# Altium schematic sheet MainSchematic.SchDoc
size A3
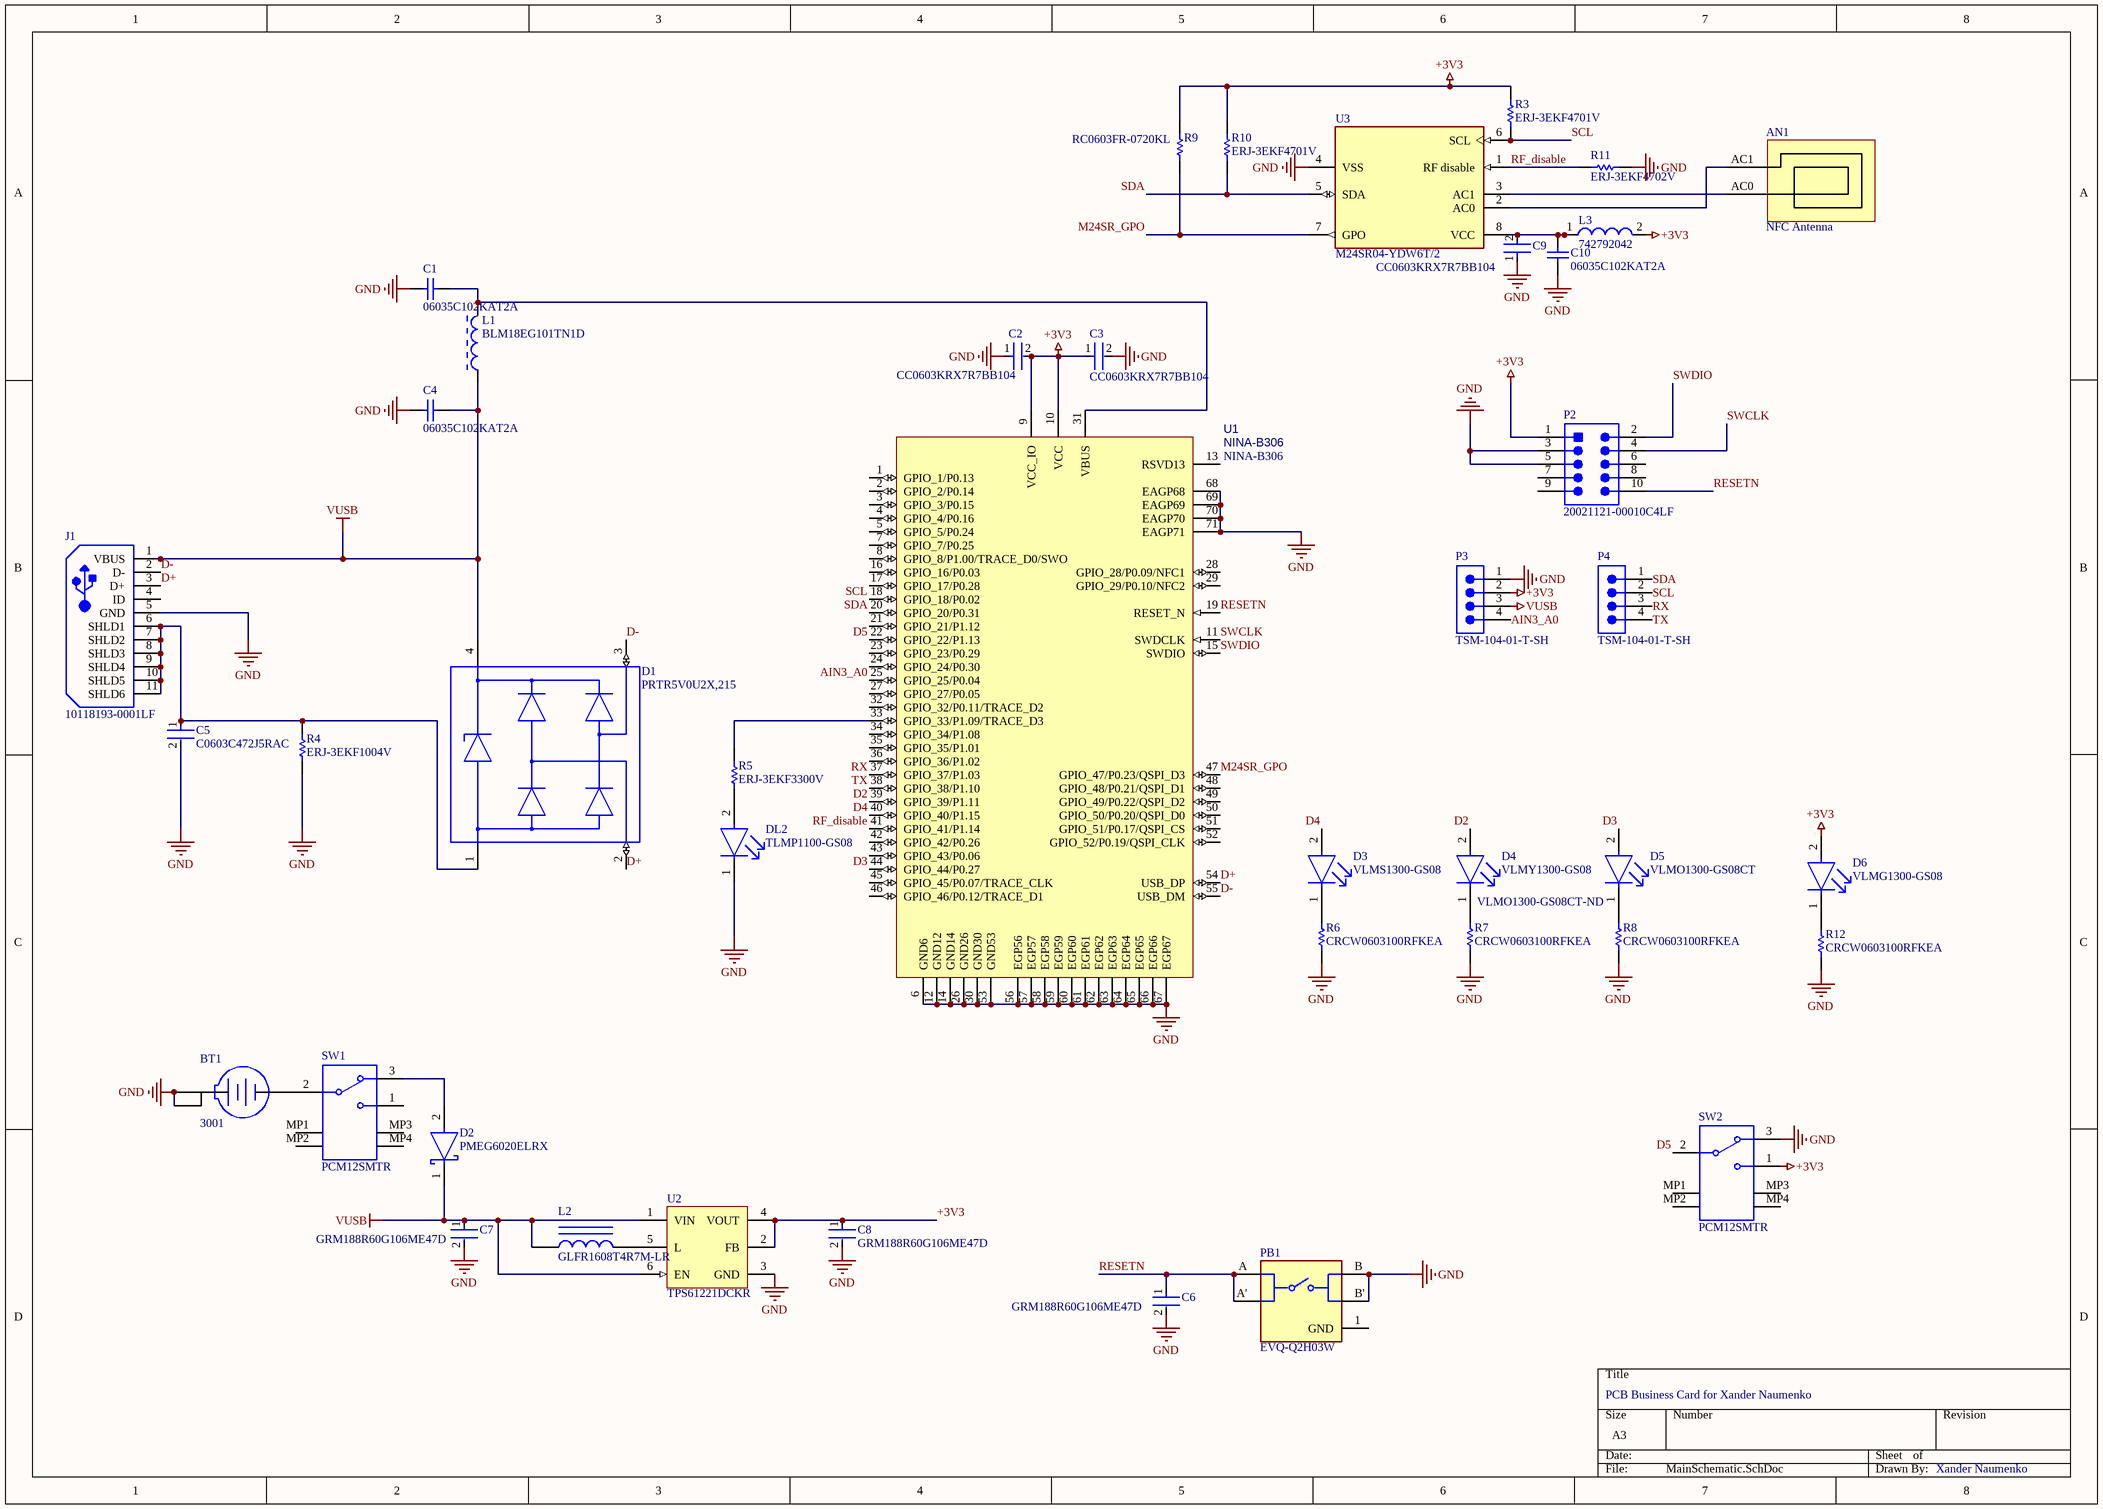
[diagram p0: MainSchematic.SchDoc]

## Parts
AN1  NFC Antenna  [NFC_Antenna]
BT1  3001  [KSTN-3001_V]
C1  06035C102KAT2A  [CAPC1608X90X35LL15T15]
C2  CC0603KRX7R7BB104  [FP-CC0603-DA-MFG]
C3  CC0603KRX7R7BB104  [FP-CC0603-DA-MFG]
C4  06035C102KAT2A  [CAPC1608X90X35LL15T15]
C5  C0603C472J5RAC  [FP-C0603C-CF-MFG]
C6  GRM188R60G106ME47D  [FP-GRM188-0_1-e0_2_0_55-IPC_B]
C7  GRM188R60G106ME47D  [FP-GRM188-0_1-e0_2_0_55-IPC_B]
C8  GRM188R60G106ME47D  [FP-GRM188-0_1-e0_2_0_55-IPC_B]
C9  CC0603KRX7R7BB104  [FP-CC0603-DA-MFG]
C10  06035C102KAT2A  [CAPC1608X90X35LL15T15]
D1  PRTR5V0U2X,215  [FP-SOT143B-MFG]
D2  PMEG6020ELRX  [FP-SOD123W-MFG]
D3  VLMS1300-GS08  [FP-6_541-5092_01-4-MFG]
D4  VLMY1300-GS08  Supplier Part Number 1: VLMO1300-GS08CT-ND  [FP-6_541-5092_01-4-MFG]
D5  VLMO1300-GS08CT  [FP-6_541-5092_01-4-MFG]
D6  VLMG1300-GS08  [FP-6_541-5092_01-4-MFG]
DL2  TLMP1100-GS08  [FP-6_541-5056_01-4-MFG]
J1  10118193-0001LF  [FCI-10118193-0001LF-5_V]
L1  BLM18EG101TN1D  [MURA-BLM18-RF-H3-CHIP-2_V]
L2  GLFR1608T4R7M-LR  [INDC1608X100X35LL20T15]
L3  742792042  [SMD-0805]
P2  20021121-00010C4LF  [HDR2X5_SMT]
P3  TSM-104-01-T-SH  [SMTC-TSM-104-01-X-SH]
P4  TSM-104-01-T-SH  [SMTC-TSM-104-01-X-SH]
PB1  EVQ-Q2H03W  [FP-EVQ-Q2H03W-MFG]
R3  ERJ-3EKF4701V  [RESC1608X55X30NL15T15]
R4  ERJ-3EKF1004V  [RESC1608X55X30LL15T15]
R5  ERJ-3EKF3300V  [RESC1608X55X30LL15T15]
R6  CRCW0603100RFKEA  [RESC1609X50X30ML8T20]
R7  CRCW0603100RFKEA  [RESC1609X50X30ML8T20]
R8  CRCW0603100RFKEA  [RESC1609X50X30ML8T20]
R9  RC0603FR-0720KL  [RESC1608X55X25LL10T15]
R10  ERJ-3EKF4701V  [RESC1608X55X30NL15T15]
R11  ERJ-3EKF4702V  [RESC1608X55X30NL15T15]
R12  CRCW0603100RFKEA  [RESC1609X50X30ML8T20]
SW1  PCM12SMTR  [CKCP-PCM12SMTR_V]
SW2  PCM12SMTR  [CKCP-PCM12SMTR_V]
U1  NINA-B306  [NINA_LGA71R_1500X1000X223_PCB]
U2  TPS61221DCKR  [DCK0006A_L]
U3  M24SR04-YDW6T/2  [FP-TSSOP8-AM-IPC_C]

## Nets
+3V3: C2.2 C3.1 C8.1 D6.2(A) L3.2 P2.1 P3.2 R3.2 R9.2 R10.2 SW2.1 U1.9(VCC_IO) U1.10(VCC) U2.2(FB) U2.4(VOUT)
GND: BT1.1(+) BT1.2(+) C1.1 C2.1 C3.2 C4.1 C5.2 C6.2 C7.2 C8.2 C9.1 C10.1 DL2.1(C) J1.5(GND) P2.3 P2.5 P3.1 PB1.B PB1.B' R4.1 R6.1 R7.1 R8.1 R11.2 R12.1 SW2.3 U1.6(GND6) U1.12(GND12) U1.14(GND14) U1.26(GND26) U1.30(GND30) U1.53(GND53) U1.56(EGP56) U1.57(EGP57) U1.58(EGP58) U1.59(EGP59) U1.60(EGP60) U1.61(EGP61) U1.62(EGP62) U1.63(EGP63) U1.64(EGP64) U1.65(EGP65) U1.66(EGP66) U1.67(EGP67) U1.68(EAGP68) U1.69(EAGP69) U1.70(EAGP70) U1.71(EAGP71) U2.3(GND) U3.4(VSS)
VUSB: C4.2 C7.1 D1.4(VCC) D2.1(C) J1.1(VBUS) L1.1 L2.1 P3.3 U2.1(VIN) U2.6(EN)
AIN3_A0: P3.4 U1.25(GPIO_25/P0.04)
D2: D4.2(A) U1.39(GPIO_39/P1.11)
D3: D5.2(A) U1.44(GPIO_44/P0.27)
D4: D3.2(A) U1.40(GPIO_40/P1.15)
D5: SW2.2 U1.22(GPIO_22/P1.13)
D+: D1.2(I/O_1) J1.3(D+) U1.54(USB_DP)
D-: D1.3(I/O_2) J1.2(D-) U1.55(USB_DM)
M24SR_GPO: R9.1 U1.47(GPIO_47/P0.23/QSPI_D3) U3.7(GPO)
RESETN: C6.1 P2.10 PB1.A PB1.A' U1.19(RESET_N)
RF_disable: R11.1 U1.41(GPIO_41/P1.14) U3.1(RF_disable)
RX: P4.3 U1.37(GPIO_37/P1.03)
SCL: P4.2 R3.1 U1.18(GPIO_18/P0.02) U3.6(SCL)
SDA: P4.1 R10.1 U1.20(GPIO_20/P0.31) U3.5(SDA)
SWCLK: P2.4 U1.11(SWDCLK)
SWDIO: P2.2 U1.15(SWDIO)
TX: P4.4 U1.38(GPIO_38/P1.10)
NetAN1_AC0: AN1.AC0 U3.3(AC1)
NetAN1_AC1: AN1.AC1 U3.2(AC0)
NetBT1_3: BT1.3(-) SW1.2
NetC1_2: C1.2 L1.2 U1.31(VBUS)
NetC5_1: C5.1 D1.1(GND) J1.6(SHLD1) J1.7(SHLD2) J1.8(SHLD3) J1.9(SHLD4) J1.10(SHLD5) J1.11(SHLD6) R4.2
NetC9_2: C9.2 C10.2 L3.1 U3.8(VCC)
NetD2_2: D2.2(A) SW1.3
NetD3_1: D3.1(C) R6.2
NetD4_1: D4.1(C) R7.2
NetD5_1: D5.1(C) R8.2
NetD6_1: D6.1(C) R12.2
NetDL2_2: DL2.2(A) R5.1
NetL2_2: L2.2 U2.5(L)
NetR5_2: R5.2 U1.33(GPIO_33/P1.09/TRACE_D3)

Not connected (* = marked no-connect by the designer): J1 4(ID); P2 6 7 8 9; PB1 1(GND); SW1 1 MP1 MP2 MP3 MP4; SW2 MP1 MP2 MP3 MP4; U1 1(GPIO_1/P0.13) 2(GPIO_2/P0.14) 3(GPIO_3/P0.15) 4(GPIO_4/P0.16) 5(GPIO_5/P0.24) 7(GPIO_7/P0.25) 8(GPIO_8/P1.00/TRACE_D0/SWO) 13(RSVD13) 16(GPIO_16/P0.03) 17(GPIO_17/P0.28) 21(GPIO_21/P1.12) 23(GPIO_23/P0.29) 24(GPIO_24/P0.30) 27(GPIO_27/P0.05) 28(GPIO_28/P0.09/NFC1) 29(GPIO_29/P0.10/NFC2) 32(GPIO_32/P0.11/TRACE_D2) 34(GPIO_34/P1.08) 35(GPIO_35/P1.01) 36(GPIO_36/P1.02) 42(GPIO_42/P0.26) 43(GPIO_43/P0.06) 45(GPIO_45/P0.07/TRACE_CLK) 46(GPIO_46/P0.12/TRACE_D1) 48(GPIO_48/P0.21/QSPI_D1) 49(GPIO_49/P0.22/QSPI_D2) 50(GPIO_50/P0.20/QSPI_D0) 51(GPIO_51/P0.17/QSPI_CS) 52(GPIO_52/P0.19/QSPI_CLK)

## Notes on the sheet
- PCB Business Card for Xander Naumenko
- Xander Naumenko

## Library data of the parts
AN1 = NFC_Antenna: L=5.51 uH, tuned for 13.56 MHz; L: 5.51 uH
BT1 = CMP-2000-05463-1: Holder Battery Coin, 12 mm, 2-Pin THD, RoHS; Manufacturer: Keystone; Package Reference: 3001; Package Description: 2-Pin Through Hole Device, Body 13.21 x 12.07 mm; Datasheet Version: Rev. H, 09/2006; Datasheet URL: https://datasheet.ciiva.com/3/3001-3954.pdf; Mounting Technology: ThroughHole; Manufacturer URL: http://www.keyelco.com/
C1 C4 C10 = CMP-2006-04378-1: Manufacturer: AVX Interconnect / Elco; Part Number: 06035C102KAT2A
C2 C3 C9 = CMP-2000-05002-2: CAP CER 0.1UF 16V X7R 0603; Manufacturer: YAGEO; Tolerance: 0.1; Value: 100 nF; Temperature Coefficient: 15%; Description: CC0603 100 nF X7R 10.00% 16 V; Material: Ceramic; Voltage Rating: 16 V; Package: CC0603-DA; ComponentLink2Description: Datasheet; Octopart: https://octopart.com/cc0603krx7r7bb104-yageo-192941; Temperature Range High: +125°C; Digikey Description: CAP CER 0.1UF 16V X7R 0603; Voltage: 16 V; Device Class L2: Capacitors; Height: 0.9mm; Temperature: -55°C to +125°C; Manufacturer Part Number: CC0603KRX7R7BB104; Device Class L1: Passive Components; Device Class L3: Ceramic Capacitors; ComponentLink2URL: http://www.yageo.com/documents/recent/UPY-GPHC_X7R_6.3V-to-50V_18.pdf; Footprint Url: http://www.yageo.com/exep/pages/download/literatures/UPY-C_GEN_24.pdf; RoHS: TRUE; Temperature Range Low: -55°C; Temperature Characteristic: X7R; Lead Free: Yes; Capacitance: 100 nF; Category: Cap; Mouser Description: Multilayer Ceramic Capacitor, CC Series, 0.1 - F, - 10%, X7R, 16 V, 0603 [1608 Metric]; Automotive: No
C5 = CMP-03020-004543-2: C0603 4,700 pF X7R 30ppm/°C 5.00% 50 V; Manufacturer: KEMET; Material: Ceramic; Automotive Grade: Grade 1; Tolerance: 0.05; Voltage Rating: 50 V; Octopart: https://octopart.com/c0603c472j5rac-kemet-965121; Automotive: Yes; Temperature: -55°C to +125°C; Temperature Characteristic: X7R; Value: 4,700 pF; Manufacturer Part Number: C0603C472J5RAC; RoHS: TRUE; Height: 0.87mm; ComponentLink2Description: Datasheet; ComponentLink2URL: https://api.kemet.com/component-edge/download/datasheet/C0603C100J5GACAUTO.pdf; Device Class L1: Passive Components; Mouser Description: Cap Ceramic 0.0047uF 50V X7R 5% Pad SMD 0603 125C Bag; Device Class L3: Ceramic Capacitors; Temperature Coefficient: 30ppm/°C; Temperature Range High: +125°C; Lead Free: Yes; Package: C0603C-CF; Capacitance: 4,700 pF; Temperature Range Low: -55°C; Category: Cap; Device Class L2: Capacitors
C6-C8 = CMP-2006-02787-5: Chip Multilayer Ceramic Capacitors for General Purpose, 0603, 10uF, X5R, 15%, 20%, 4V; Case/Package: 0603; Thickness: 0.035inch; Mount: Surface Mount; Capacitance: 10uF; Package Quantity: 4000; Tolerance: 20%; Depth: 0.8mm; Voltage: 4V; Height: 0.8mm; Length: 1.6mm; Packaging: Tape and Reel; Case Code (Imperial): 0603; Voltage Rating: 4V; Radiation Hardening: No; Dielectric: X5R; Max Operating Temperature: 85°C; Voltage Rating (DC): 4V; Min Operating Temperature: -55°C; Termination: SMD/SMT; Width: 0.8mm; Case Code (Metric): 1608; Lead Free: Lead Free
D1 = CMP-14436-000007-1: TVS DIODE 5.5V SOT143B; Manufacturer: Nexperia; Package: SOT-143B
D2 = CMP-14398-000020-1: DIODE SCHOTTKY 60V 2A SOD123W
D3 = CMP-02520-000012-1: LED RED 0603 SMD; Manufacturer: Vishay; Forward Voltage: 2V; Reverse Voltage: 5V; Power Dissipation: 75mW; Description: Red 631nm LED Indication - Discrete 2V 0603 (1608 Metric); Forward Current: 20mA; Luminous Intensity: 54mcd; Led Orientation: Top View; Peak Emmision Wavelength: 639nm; Viewing Angle: 130°; Wavelength: 631nm; Digikey Description: LED RED 0603 SMD; Height: 1mm; Colour: Red; Ambient Temperature Range High: +85°C; Ambient Temperature Range Low: -35°C; Package: 6.541-5092.01-4; Automotive: No; Temperature Range High: +85°C; Device Class L3: unset; Lead Free: Yes; Temperature Range Low: -35°C; Temperature: -35°C to +85°C; Manufacturer Part Number: VLMS1300-GS08; Device Class L2: LEDs; ComponentLink2Description: Datasheet; Octopart: https://octopart.com/vlms1300-gs08-vishay-21709201; Device Class L1: Optoelectronics; RoHS: TRUE; ComponentLink2URL: http://www.vishay.com/docs/82437/vlmo1300.pdf; Mouser Description: Standard LEDs - SMD Super Red Clear Non-Diff; Category: Diode
D4 = CMP-02520-000001-1: LED YELLOW 0603 SMD; Manufacturer: Vishay; Led Orientation: Top View; Viewing Angle: 130°; Peak Emmision Wavelength: 588nm; Description: LED Uni-Color Yellow 588nm 2-Pin Chip 0603(1608Metric) T/R; Wavelength: 597nm; Luminous Intensity: 28-180mcd; Forward Voltage: 2.4V; Power Dissipation: 75mW; Forward Current: 20mA; Reverse Voltage: 5V; Color: Orange; Number of LEDs: 1; Dominant Wavelength: 605nm; Lens Style: Clear,Rectangular; Octopart: https://octopart.com/vlmy1300-gs08-vishay-21709204; Temperature Range Low: -35°C; Temperature Range High: +85°C; Device Class L2: LEDs; Device Class L3: unset; RoHS: TRUE; ComponentLink2URL: https://www.vishay.com/docs/82437/vlmo1300.pdf; Category: Diode; Ambient Temperature Range High: +85°C; Manufacturer Part Number: VLMY1300-GS08; Ambient Temperature Range Low: -35°C; Height: 1mm; Temperature: -35°C to +85°C; Package: 6.541-5092.01-4; Lead Free: Yes; Device Class L1: Optoelectronics; Digikey Description: LED YELLOW 0603 SMD; ComponentLink2Description: Datasheet; Colour: Yellow; Automotive: No; Supplier 1: Digi-Key; Stock 1: 8992; Pricing 1: 1=0.30000, 10=0.23500, 100=0.10540, 500=0.09520, 1000=0.07820 (USD); Mount: Surface Mount; Case/Package: 0603; Number of Pins: 2; Case Code (Imperial): 0603; Case Code (Metric): 1608; Min Operating Temperature: -35°C; Max Operating Temperature: 85°C; Illumination Color: Orange; Power Rating: 75mW; Packaging: Tape and Reel; Test Current: 20mA; Package Quantity: 1; Number of Elements: 1; Length: 1.6mm; Width: 0.8mm; Depth: 0.8mm; Radiation Hardening: No; REACH SVHC: Unknown; ComponentLink1URL: https://datasheet.ciiva.com/9333/vlmo1300-9333742.pdf?src-supplier=Avnet; ComponentLink1Description: https://datasheet.ciiva.com/9333/vlmo1300-9333742.pdf?src-supplier=Avnet; ComponentLink3URL: https://datasheet.ciiva.com/26322/vlmo1300-26322143.pdf?src-supplier=Element14; ComponentLink3Description: https://datasheet.ciiva.com/26322/vlmo1300-26322143.pdf?src-supplier=Element14; ComponentLink4URL: https://datasheet.ciiva.com/16388/vlmo1300-16388054.pdf?src-supplier=Future+Electronics; ComponentLink4Description: https://datasheet.ciiva.com/16388/vlmo1300-16388054.pdf?src-supplier=Future+Electronics; ComponentLink5URL: https://datasheet.ciiva.com/2114/vlmo1300-2114968.pdf?src-supplier=Digi-Key; ComponentLink5Description: https://datasheet.ciiva.com/2114/vlmo1300-2114968.pdf?src-supplier=Digi-Key; ComponentLink6URL: https://datasheet.ciiva.com/2114/vlmo1300-2114969.pdf?src-supplier=Digi-Key; ComponentLink6Description: https://datasheet.ciiva.com/2114/vlmo1300-2114969.pdf?src-supplier=Digi-Key; ComponentLink7URL: https://datasheet.ciiva.com/2114/vlmo1300-2114970.pdf?src-supplier=Digi-Key; ComponentLink7Description: https://datasheet.ciiva.com/2114/vlmo1300-2114970.pdf?src-supplier=Digi-Key; ComponentLink8URL: https://datasheet.ciiva.com/26218/vlmo1300-26218654.pdf?src-supplier=Avnet+Europe; ComponentLink8Description: https://datasheet.ciiva.com/26218/vlmo1300-26218654.pdf?src-supplier=Avnet+Europe
D5 = CMP-02520-000001-1: LED YELLOW 0603 SMD; Manufacturer: Vishay; Manufacturer Part Number: VLMY1300-GS08; Led Orientation: Top View; Viewing Angle: 130°; Peak Emmision Wavelength: 588nm; Description: LED Uni-Color Yellow 588nm 2-Pin Chip 0603(1608Metric) T/R; Wavelength: 597nm; Luminous Intensity: 28-180mcd; Forward Voltage: 2.4V; Power Dissipation: 75mW; Forward Current: 20mA; Reverse Voltage: 5V; Octopart: https://octopart.com/vlmy1300-gs08-vishay-21709204; Temperature Range Low: -35°C; Temperature Range High: +85°C; Device Class L2: LEDs; Device Class L3: unset; RoHS: TRUE; ComponentLink2URL: https://www.vishay.com/docs/82437/vlmo1300.pdf; Category: Diode; Ambient Temperature Range High: +85°C; Ambient Temperature Range Low: -35°C; Height: 1mm; Temperature: -35°C to +85°C; Package: 6.541-5092.01-4; Lead Free: Yes; Device Class L1: Optoelectronics; Digikey Description: LED YELLOW 0603 SMD; ComponentLink2Description: Datasheet; Colour: Yellow; Automotive: No; Supplier 1: Digi-Key
D6 = CMP-02520-000011-1: LED GREEN 0603 SMD; Manufacturer: Vishay; Peak Emmision Wavelength: 574nm; Power Dissipation: 75mW; Viewing Angle: 130°; Reverse Voltage: 5V; Led Orientation: Top View; Forward Current: 20mA; Colour: Yellow Green; Description: Green 571nm LED Indication - Discrete 2V 0603 (1608 Metric); Forward Voltage: 2V; Luminous Intensity: 35mcd; Wavelength: 571nm; Height: 1mm; Mouser Description: LED; SMD; 0603; yellow green; 18-35mcd; 1.6x0.8x0.8mm; 130°; 2÷2.4V; Category: Diode; Temperature: -35°C to +85°C; Ambient Temperature Range Low: -35°C; Package: 6.541-5092.01-4; RoHS: TRUE; Device Class L2: LEDs; ComponentLink2Description: Datasheet; Device Class L3: unset; Octopart: https://octopart.com/vlmg1300-gs08-vishay-21709199; Device Class L1: Optoelectronics; Temperature Range Low: -35°C; Manufacturer Part Number: VLMG1300-GS08; Automotive: No; Lead Free: Yes; Ambient Temperature Range High: +85°C; Digikey Description: LED GREEN 0603 SMD; Temperature Range High: +85°C; ComponentLink2URL: http://www.vishay.com/docs/82437/vlmo1300.pdf
DL2 = CMP-02520-000009-1: LED GREEN 0603 SMD; Manufacturer: Vishay; Max Junction Temp: +120°C; Automotive Grade: Grade 3; Reverse Voltage: 6V; Led Orientation: Top View; Forward Voltage: 2.1V; Luminous Intensity: 15mcd; Forward Current: 20mA; Peak Emmision Wavelength: 562nm; Wavelength: 561nm; Viewing Angle: 160°; Power Dissipation: 90mW; Digikey Description: LED GREEN 0603 SMD; Package: 0603; Ambient Temperature Range High: +100°C; Height: 0.65mm; Device Class L1: Optoelectronics; Device Class L2: LEDs; Mouser Description: Standard LEDs - SMD Pure Green; Temperature Range High: +120°C; RoHS: TRUE; Ambient Temperature Range Low: -40°C; Temperature: to +120°C; Manufacturer Part Number: TLMP1100-GS08; ComponentLink2URL: http://www.vishay.com/docs/83173/tlmb1100.pdf; Lead Free: Yes; Octopart: https://octopart.com/tlmp1100-gs08-vishay-55433993; Colour: Pure green; Automotive: Yes; Device Class L3: unset; ComponentLink2Description: Datasheet; Category: Diode
J1 = CMP-2000-05119-1: Micro USB B Type Receptacle, -55 to 85 degC, 5-Pin SMD, RoHS, Tape and Reel; Manufacturer: FCI; Insulation Resistance: 1000MOhms; Gender: Female; Current Rating: 1.8A; Number of Contacts: 5Contact; Connector Type: MicroUSBTypeBreceptacle; Mounting Angle: Right; Datasheet Version: Rev. C, 05/2015; Packaging: Reel; Product Category: USBConnectors; Standard: USB2.0; Factory Pack Quantity: 1200; Operating Temperature Range: -55Cto+85C; Termination Style: SMD/SMT; Datasheet URL: http://datasheet.octopart.com/10118193-0001LF-FCI-datasheet-55953155.pdf; Contact Material: CopperAlloy; RoHS: Details; Contact Plating: Gold; Flammability Rating: UL94V-0; Manufacturer URL: http://www.fci.com/; Brand: FCI; Product: MicroUSBTypeBConnectors; Color: Black
L1 = CMP-0686-00530-2: Chip Ferrite Bead for GHz Band General Use (Low DC Resistance Type), 100 Ohm, 2000 mA, -55 to 125 degC, 1.6 x 0.8 x 0.65 mm SMD, Tape and Reel; Manufacturer: Murata; Rated Current: 2000 mA; Impedance (at 100 MHz): 100 Ohm +/- 25%; DC Resistance: 0.045 Ohm Max.; ComponentLink3Description: Package Specification; ComponentLink2URL: http://www.murata.com/products/catalog/pdf/c31e.pdf; DatasheetVersion: 08/2013; ComponentLink1Description: Manufacturer URL; Packing: Tape and Reel; PackageDescription: 2-Pin Chip, Body 1.6 x 0.8 mm; Operating Temperature Range: -55 to 125 degC; ComponentLink1URL: http://www.murata.com/; ComponentLink2Description: Datasheet; Mounting Technology: Surface Mount; PartNumber: BLM18EG101TN1D; ComponentLink3URL: http://www.murata.com/products/catalog/pdf/c31e.pdf; PackageReference: BLM18_H650-2; Package: 0603
L2 = CMP-2000-06322-1: Chip Inductor, 4.7 uH, +/- 20%, -40 to 105 degC, 0603 (1608 Metric), RoHS, Tape and Reel; Manufacturer: TDK; DC Resistance (DCR): 240mOhm; Dynamic Catalog: GLFRSeries; Catalog Drawings: 1608(0603)Top / 1608(0603)Side; Other Names: 445-3607-2; Inductance: 4.7µH; Other Related Documents: 1608(0603)Footprint; Current Rating: 110mA; Shielding: Shielded; Current - Saturation: 170mA; Mounting Technology: SurfaceMount; Manufacturer URL: http://www.tdk.com/; Family: FixedInductors; Datasheet URL: http://media.digikey.com/pdf/Data%20Sheets/TDK%20PDFs/GLFR%20Series.pdf; Package / Case: 0603(1608Metric); Package Description: 2-Pin Surface Mount Device, Body 1.6 x 0.8 mm; Standard Package: 4,000; Mounting Type: SurfaceMount; Category: Inductors,Coils,Chokes; Series: GLFR; Datasheet Version: 07/2008; Operating Temperature: -40°C~105°C; Package Reference: 0603; Packaging: Tape&Reel(TR); Tolerance: ±20%; Size / Dimension: 0.063"Lx0.031"Wx0.031"H(1.60mmx0.80mmx0.80mm)
L3 = CMP-0220-00097-1: SMD EMI Suppression Ferrite Bead WE-CBF, Z = 600 Ohm; Impedance: 600 Ohm; PackageDescription: Chip Inductor, 2-Leads, Body 2.0 x 1.2 mm; ComponentLink1Description: Manufacturer Link; PackageVersion: 2005; PackageReference: SMD-0805; ComponentLink2URL: http://www.we-online.de/katalog/media/pdf/742792042.pdf; ComponentLink2Description: Datasheet; DatasheetVersion: Dec-2005; ComponentLink1URL: http://www.we-online.com
P2 = CMP-2000-05523-1: Male Header, Pitch 1.27 mm, 2 x 5 Position, Height 4.55 mm, -40 to 85 degC, RoHS, Tape and Reel; Brand: FCI; Mating Post Length: 3.05mm; Voltage Rating: 125V; Contact resistance Max: 30MOhm; Number of Positions: 10; Pitch: 1.27mm; Current Rating: 1A; Stack Height: 3mm; Mounting Angle: Vertical; Package Version: Rev. J, 03/2013; Contact Plating: Gold; Packaging: Reel; Package Reference: 20021121; Termination Style: SMD; Series: Minitek; Mounting Technology: SurfaceMount; RoHS: Details; Manufacturer: FCI; Number of Rows: 2; Package Description: 10-Leads Header, Body 3.43 x 6.35, Pitch 1.27 mm; Datasheet URL: https://datasheet.ciiva.com/11749/0900766b8118d62a-11749057.pdf; Gender: Male; Mounting Style: SMD/SMT; Manufacturer URL: http://portal.fciconnect.com/; Factory Pack Quantity: 600; Type: Unshrouded; Number of Positions / Contacts: 10; Datasheet Version: 06/2011; Package URL: https://datasheet.ciiva.com/26853/getdatasheetpartid-177140-26853984.pdf; Product Type: Headers; Contact Material: CopperAlloy; Product Category: Headers&WireHousings; Package: SMT 10P
P3 P4 = CMP-1024-00223-1: 0.025" SQ Post Header, Surface Mount, Horizontal, -55 to 105 degC, 2.54 mm Pitch, 4-Pin, Male, RoHS; Manufacturer: Samtec; Pitch: 2.54 mm; ComponentLink1URL: http://www.samtec.com; ComponentLink3URL: http://www.samtec.com/documents/webfiles/cpdf/TSM-1XX-XX-XXX-SH-XX-XXX-XX-MKT1.pdf; Temperature Range: -55 to 105 degC; Orientation: Horizontal; ComponentLink1Description: Manufacturer URL; PackageReference: TSM-104-01-X-SH; PackageDescription: Terminal Strip Single Surface Mount; ComponentLink2Description: Datasheet; ComponentLink2URL: http://www.samtec.com/documents/webfiles/pdf/TSM.PDF; RoHS: True; ComponentLink3Description: Package Specification; Mounting Technology: Surface Mount; PackageVersion: CD, 7/1991; PartNumber: TSM-104-01-T-SH; DatasheetVersion: F-214
PB1 = CMP-05618-000002-1: SWITCH TACTILE SPST-NO 0.02A 15V; Manufacturer: Panasonic Electronic Components; Electromechanical Life: 1000000Cycles; Contact Current Rating: 20mA; Contact Resistance: 100mΩ; Operating Force: 1N; Height: 3.3mm; ComponentLink2URL: https://industrial.panasonic.com/ac/cdn/e/control/switch/light-touch/catalog/sw_lt_eng_6s_th.pdf; Category: Switch; Mouser Description: Switch Tactile ON OFF SPST Round Button J-Bend 0.02A 15VDC 1N SMD Embossed T/R; Mount: Surface Mount; Temperature: -40°C to +85°C; Throw Configuration: SPST-NO; Digikey Description: SWITCH TACTILE SPST-NO 0.02A 15V; Device Class L1: Electromechanical; ComponentLink2Description: Datasheet; Manufacturer Part Number: EVQ-Q2H03W; Device Class L3: Tactile Switches; RoHS: TRUE; Device Class L2: Switches; Temperature Range High: +85°C; Temperature Range Low: -40°C; Octopart: https://octopart.com/evq-q2h03w-panasonic-1368538; Voltage Rating Dc: 15V; Package: SMT 4P; Automotive: No; Lead Free: Yes
R3 R10 = CMP-1012-00586-3: Precision Thick Film Chip Resistor, 4.7 KOhm, +/- 1%, -55 to 155 degC, 0603 (1608 Metric), RoHS, Tape and Reel; Resistance: 220 Ohm; Voltage Rating: 50 V; Elements: 4; Case\Package: 1205; Tolerance: 5%; Power Rating: 250 mW; PackageReference: 0603; Max Operating Temperature: 125 degC; REACH SVHC: No SVHC; Width: 0.063 inch; Length: 0.126 inch; Height: 0.024 inch; Mount: Surface Mount; Package Quantity: 1; DatasheetVersion: Apr-15; ComponentLink1Description: Manufacturer URL; Min Operating Temperature: -55 degC; Packaging: Tape and Reel; Radiation Hardening: No; ComponentLink2URL: http://industrial.panasonic.com/cdbs/www-data/pdf/RDA0000/AOA0000C86.pdf; Case Code (Metric): 3216; Pins: 8; Case Code (Imperial): 1206; Type (Resistor): Thick Film; RoHSCompliant: true; ComponentLink2Description: Datasheet; PackageDescription: 2-Pin Surface Mount Device, Body 1.6 x 0.85 mm; ComponentLink1URL: http://www.panasonic.com/
R4 = CMP-1012-00849-2: Manufacturer: Panasonic; Part Number: ERJ-3EKF1004V
R5 = CMP-2000-00435-2: Chip Resistor, 330 Ohm, +/- 1%, 0.1 W, -55 to 155 degC, 0603 (1608 Metric), RoHS, Tape and Reel; Gender: Male; Mating Cycles: 10000; Current Rating: 500 mA; Voltage Rating: 10 V; REACH SVHC: No SVHC; PackageDescription: 2-Pin Surface Mount Device, Body 1.6 x 0.85 mm; Contact Finish: Gold; Pins: 8; ComponentLink1Description: Manufacturer URL; Packaging: Tape and Reel; Max Operating Temperature: 85 degC; Contact Material: Copper; Height: 1.45 mm; Width: 1.45 mm; DatasheetVersion: Apr-15; Package Quantity: 1500; Contact Plating: Gold; PackageReference: 0603; Mount: Surface Mount; Lead Pitch: 1.1 mm; Min Operating Temperature: -25 degC; ComponentLink1URL: http://www.panasonic.com/; ComponentLink2URL: http://industrial.panasonic.com/cdbs/www-data/pdf/RDA0000/AOA0000C86.pdf; Length: 13.7 mm; ComponentLink2Description: Datasheet; RoHSCompliant: true
R6-R8 R12 = CMP-2000-03824-5: Chip Resistor, 100 Ohm, +/- 1%, 100 mW,-55 to 155 degC, 0603 (1608 Metric), RoHS, Tape and Ree; Manufacturer: Vishay Semiconductor; ComponentLink2URL: http://www.vishay.com/docs/20035/dcrcwe3.pdf; ComponentLink1URL: http://www.vishay.com/; Mounting Technology: Surface Mount; ComponentLink1Description: Manufacturer URL; ComponentLink2Description: Datasheet; PackageDescription: 2-Pin Surface Mount Device, Body 1.575 x 0.85 mm; PackageReference: 0603; DatasheetVersion: 06/2012
R9 = CMP-2000-06932-1: Chip Resistor, 20 KOhm, +/- 1%, 0.1 W, -55 to 155 degC, 0603 (1608 Metric), RoHS, Tape and Reel; Manufacturer: Yageo; Power Rating: 100mW; Temperature Coefficient: 100PPM/C; Resistance: 20kOhms; Voltage Rating: 50V; Case Code - in: 0603; Packaging: Reel; Datasheet Version: Rev. 7, 05/2017; Series: RC; Mounting Technology: SurfaceMount; Product: ThickFilmResistorsGeneralPurpose; Manufacturer URL: http://www.yageo.com/; Package Description: 2-Pin Surface Mount Device, Body 1.6 x 0.8 mm; Package Reference: 0603; Termination Style: SMD/SMT; Case Code - mm: 1608; Operating Temperature Range: -55Cto+155C; Datasheet URL: http://www.yageo.com/documents/recent/PYu-RC_Group_51_RoHS_L_7.pdf; Tolerance: 1%
R11 = CMP-2000-00523-2: Chip Resistor, 47 KOhm, +/- 1%, 0.1 W, -55 to 155 degC, 0603 (1608 Metric), RoHS, Tape and Reel; Case\Package: 0603; Forward Current: 20 mA; Power Rating: 90 mW; Illumination Colour: Red; Nominal Vf: 2.1 V; Viewing Angle: 160 degrees; Luminous Intensity: 63 mcd; Lens Style: Clear; Nominal Wavelength: 639 nm; Case Code (Imperial): 0603; Case Code (Metric): 1608; Packaging: Tape and Reel; Radiation Hardening: No; Colour: Red; PackageDescription: 2-Pin Surface Mount Device, Body 1.6 x 0.85 mm; ComponentLink1Description: Manufacturer URL; Width: 0.8 mm; DatasheetVersion: Apr-15; ComponentLink2URL: http://industrial.panasonic.com/cdbs/www-data/pdf/RDA0000/AOA0000C86.pdf; Min Operating Temperature: -40 degC; Height: 0.6 mm; Package Quantity: 3000; ComponentLink2Description: Datasheet; REACH SVHC: No SVHC; ComponentLink1URL: http://www.panasonic.com/; Mount: Surface Mount; RoHSCompliant: true; Max Operating Temperature: 100 degC; PackageReference: 0603; Length: 1.6 mm; Forward Voltage: 2.1 V; Pins: 2
SW1 SW2 = CMP-2000-06884-1: Ultraminiature Slide Switch, SPDT, 0.3 A, 6 V, -20 to 85 degC, 3-Pin SMD, RoHS, Tape and Reel; Manufacturer: C&K Components; Switch Operation: On-On; Contact Current-Max: 0.3A; Datasheet Version: 02/2016; Package Reference: PCM12SMTR; Package Description: 3-Pin Surface Mount Device, Body 6.7 x 2.6 mm; Contact Material: SilverOverCopper; Mounting Technology: SurfaceMount; Circuitry: SPDT; Datasheet URL: http://www.ck-components.com/media/1424/pcm.pdf; Termination Style: RightAngle/SurfaceMount; Manufacturer URL: http://www.ckswitches.com/
U1 = NINA-B306: Stand-alone Bluetooth low energy module; Manufacturer: u-blox; Part Description: Stand-alone Bluetooth low energy module; Value: NINA-B306; Package: 55-SMD
U2 = CMP-0343-00082-2: Boost Voltage Converter with 0.7 to 5.5 V Input and 3.3 V Output, -40 to 85 degC, 6-Pin SC70 (DCK), Green (RoHS & no Sb/Br); Manufacturer: Texas Instruments; Switching Frequency(Max)(kHz): 2000; Vin(Max)(V): 5.5; Regulated Outputs(#): 1; Vout(Min)(V): 3.3; Vin(Min)(V): 0.7; SubFamily: Step-Up Regulator; ComponentLink1Description: Datasheet; PartNumber: TPS61221DCKR; Topology: Boost; DatasheetVersion: SLVS776; Vout(Max)(V): 3.3; Code_JEDEC: MO-203-AB; ComponentLink2URL: http://www.ti.com/litv/pdf/mpds114c; PackageReference: DCK0006A; ComponentLink1URL: http://www.ti.com/general/docs/lit/getliterature.tsp?genericPartNumber=TPS61221&fileType=pdf; PackageVersion: revG, Jan-2007; ComponentLink2Description: Package Specification; PackageDescription: 6-Pin Plastic Small-Outline Package, 2 x 1.3 mm Body, 0.65 mm Pitch, 2.1 mm Lead Span; Eco-Plan: Green (RoHS & no Sb/Br); Mounting Technology: Surface Mount
U3 = CMP-12160-000009-1: IC RFID TRANSP 13.56MHZ 8TSSOP; Manufacturer: STMicroelectronics; Automotive Grade: NA; Max Supply Voltage: 5.5V; Min Supply Voltage: 2.7V; Standoff Height: 0.05mm; Nominal Supply Current: 150-550uA; Max Frequency: 13.567MHz; Data Rate: 106kbits/s; ComponentLink2URL: https://www.st.com/resource/en/datasheet/m24sr04-y.pdf; RoHS: TRUE; Octopart: https://octopart.com/m24sr04-ydw6t%2F2-stmicroelectronics-31443742; Height: 1.2mm; Temperature: -40°C to +85°C; Category: IC; ComponentLink2Description: Datasheet; Ambient Temperature Range Low: -40°C; Automotive: No; Device Class L1: Integrated Circuits (ICs); Temperature Range High: +85°C; Device Class L2: RF Semiconductors and Devices; Package: TSSOP8-AM; Temperature Range Low: -40°C; Manufacturer Part Number: M24SR04-YDW6T/2; Mouser Description: RFID Transponders 4-Kbit Dynamic NFC RFID tag EEProm; Ipc Land Pattern Name: SOP65P640X120-8; Ambient Temperature Range High: +85°C; Digikey Description: IC RFID TRANSP 13.56MHZ 8TSSOP; Device Class L3: Transceivers; Lead Free: Yes